# EAGLE schematic XmasRings (EAGLE 7.5.0)
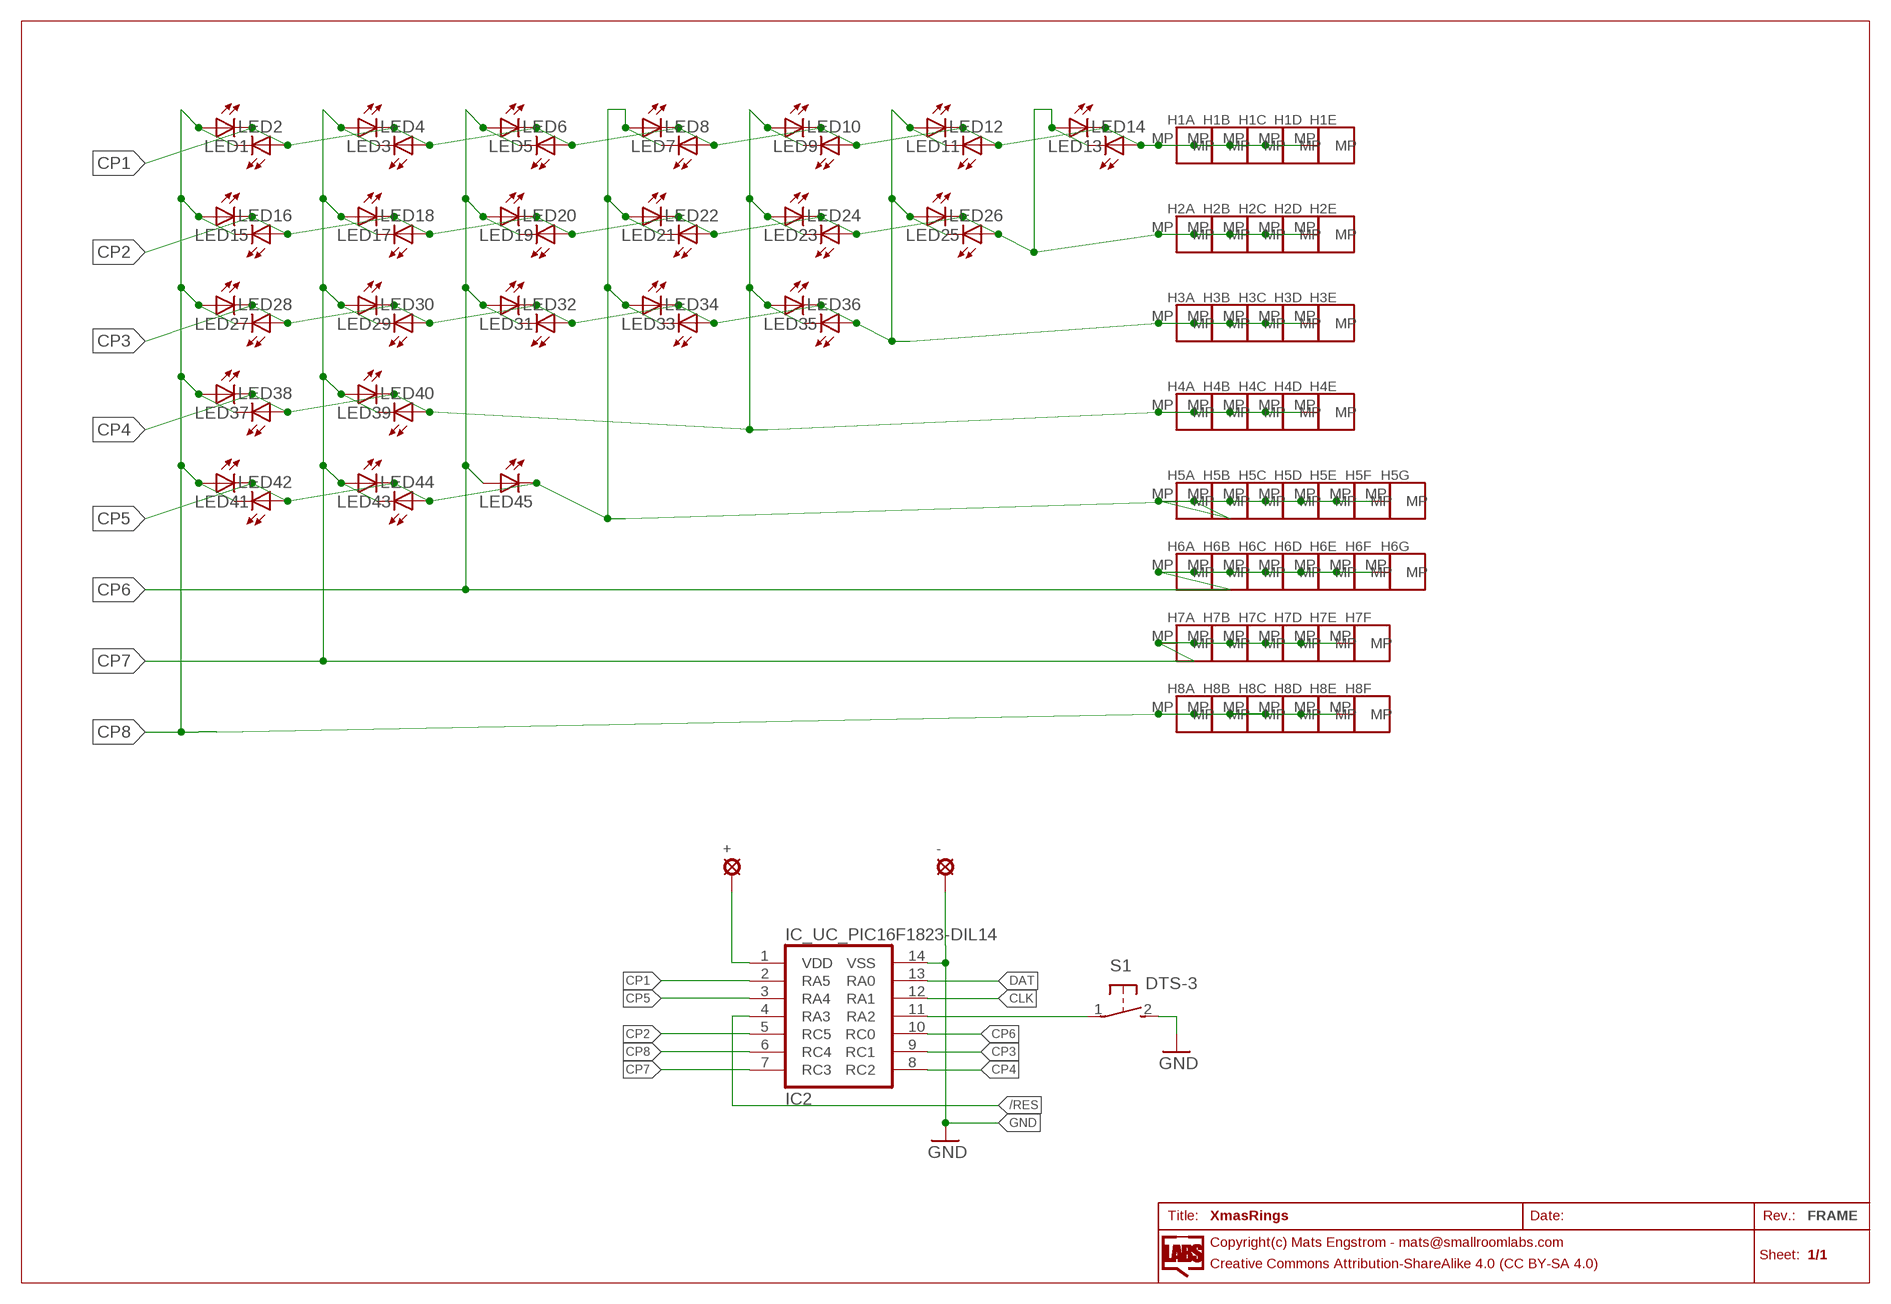
[diagram p0: schematic, sheet 1]

## Parts
+  LSP10  [LSP10]
-  LSP10  [LSP10]
H1A  PADH08SS  [PAD08SS]
H1B  PADH08SS  [PAD08SS]
H1C  PADH08SS  [PAD08SS]
H1D  PADH08SS  [PAD08SS]
H1E  PADH08SS  [PAD08SS]
H2A  PADH08SS  [PAD08SS]
H2B  PADH08SS  [PAD08SS]
H2C  PADH08SS  [PAD08SS]
H2D  PADH08SS  [PAD08SS]
H2E  PADH08SS  [PAD08SS]
H3A  PADH08SS  [PAD08SS]
H3B  PADH08SS  [PAD08SS]
H3C  PADH08SS  [PAD08SS]
H3D  PADH08SS  [PAD08SS]
H3E  PADH08SS  [PAD08SS]
H4A  PADH08SS  [PAD08SS]
H4B  PADH08SS  [PAD08SS]
H4C  PADH08SS  [PAD08SS]
H4D  PADH08SS  [PAD08SS]
H4E  PADH08SS  [PAD08SS]
H5A  PADH08SS  [PAD08SS]
H5B  PADH08SS  [PAD08SS]
H5C  PADH08SS  [PAD08SS]
H5D  PADH08SS  [PAD08SS]
H5E  PADH08SS  [PAD08SS]
H5F  PADH08SS  [PAD08SS]
H5G  PADH08SS  [PAD08SS]
H6A  PADH08SS  [PAD08SS]
H6B  PADH08SS  [PAD08SS]
H6C  PADH08SS  [PAD08SS]
H6D  PADH08SS  [PAD08SS]
H6E  PADH08SS  [PAD08SS]
H6F  PADH08SS  [PAD08SS]
H6G  PADH08SS  [PAD08SS]
H7A  PADH08SS  [PAD08SS]
H7B  PADH08SS  [PAD08SS]
H7C  PADH08SS  [PAD08SS]
H7D  PADH08SS  [PAD08SS]
H7E  PADH08SS  [PAD08SS]
H7F  PADH08SS  [PAD08SS]
H8A  PADH08SS  [PAD08SS]
H8B  PADH08SS  [PAD08SS]
H8C  PADH08SS  [PAD08SS]
H8D  PADH08SS  [PAD08SS]
H8E  PADH08SS  [PAD08SS]
H8F  PADH08SS  [PAD08SS]
IC2  IC_UC_PIC16F1823-DIL14  [DIP14]
LED1  LED5SQ  [5MM-SQ]
LED2  LED5SQ  [5MM-SQ]
LED3  LED5SQ  [5MM-SQ]
LED4  LED5SQ  [5MM-SQ]
LED5  LED5SQ  [5MM-SQ]
LED6  LED5SQ  [5MM-SQ]
LED7  LED5SQ  [5MM-SQ]
LED8  LED5SQ  [5MM-SQ]
LED9  LED5SQ  [5MM-SQ]
LED10  LED5SQ  [5MM-SQ]
LED11  LED5SQ  [5MM-SQ]
LED12  LED5SQ  [5MM-SQ]
LED13  LED5SQ  [5MM-SQ]
LED14  LED5SQ  [5MM-SQ]
LED15  LED5SQ  [5MM-SQ]
LED16  LED5SQ  [5MM-SQ]
LED17  LED5SQ  [5MM-SQ]
LED18  LED5SQ  [5MM-SQ]
LED19  LED5SQ  [5MM-SQ]
LED20  LED5SQ  [5MM-SQ]
LED21  LED5SQ  [5MM-SQ]
LED22  LED5SQ  [5MM-SQ]
LED23  LED5SQ  [5MM-SQ]
LED24  LED5SQ  [5MM-SQ]
LED25  LED5SQ  [5MM-SQ]
LED26  LED5SQ  [5MM-SQ]
LED27  LED5SQ  [5MM-SQ]
LED28  LED5SQ  [5MM-SQ]
LED29  LED5SQ  [5MM-SQ]
LED30  LED5SQ  [5MM-SQ]
LED31  LED5SQ  [5MM-SQ]
LED32  LED5SQ  [5MM-SQ]
LED33  LED5SQ  [5MM-SQ]
LED34  LED5SQ  [5MM-SQ]
LED35  LED5SQ  [5MM-SQ]
LED36  LED5SQ  [5MM-SQ]
LED37  LED5SQ  [5MM-SQ]
LED38  LED5SQ  [5MM-SQ]
LED39  LED5SQ  [5MM-SQ]
LED40  LED5SQ  [5MM-SQ]
LED41  LED5SQ  [5MM-SQ]
LED42  LED5SQ  [5MM-SQ]
LED43  LED5SQ  [5MM-SQ]
LED44  LED5SQ  [5MM-SQ]
LED45  LED5SQ  [5MM-SQ]
S1  DTS-3  [DTS-3]

## Nets
/RES: IC2.4(RA3)
CLK: IC2.12(RA1)
CP1: H1A.MP H1B.MP H1C.MP H1D.MP H1E.MP IC2.2(RA5) LED1.C LED2.A LED3.C LED4.A LED5.C LED6.A LED7.C LED8.A LED9.C LED10.A LED11.C LED12.A LED13.C LED14.A
CP2: H2A.MP H2B.MP H2C.MP H2D.MP H2E.MP IC2.5(RC5) LED13.A LED14.C LED15.C LED16.A LED17.C LED18.A LED19.C LED20.A LED21.C LED22.A LED23.C LED24.A LED25.C LED26.A
CP3: H3A.MP H3B.MP H3C.MP H3D.MP H3E.MP IC2.9(RC1) LED11.A LED12.C LED25.A LED26.C LED27.C LED28.A LED29.C LED30.A LED31.C LED32.A LED33.C LED34.A LED35.C LED36.A
CP4: H4A.MP H4B.MP H4C.MP H4D.MP H4E.MP IC2.8(RC2) LED9.A LED10.C LED23.A LED24.C LED35.A LED36.C LED37.C LED38.A LED39.C LED40.A
CP5: H5A.MP H5B.MP H5C.MP H5D.MP H5E.MP H5F.MP H5G.MP IC2.3(RA4) LED7.A LED8.C LED21.A LED22.C LED33.A LED34.C LED41.C LED42.A LED43.C LED44.A LED45.C
CP6: H6A.MP H6B.MP H6C.MP H6D.MP H6E.MP H6F.MP H6G.MP IC2.10(RC0) LED5.A LED6.C LED19.A LED20.C LED31.A LED32.C LED45.A
CP7: H7A.MP H7B.MP H7C.MP H7D.MP H7E.MP H7F.MP IC2.7(RC3) LED3.A LED4.C LED17.A LED18.C LED29.A LED30.C LED39.A LED40.C LED43.A LED44.C
CP8: H8A.MP H8B.MP H8C.MP H8D.MP H8E.MP H8F.MP IC2.6(RC4) LED1.A LED2.C LED15.A LED16.C LED27.A LED28.C LED37.A LED38.C LED41.A LED42.C
DAT: IC2.13(RA0)
GND: -.MP IC2.14(VSS) S1.2
N$1: IC2.11(RA2) S1.1
VCC: +.MP IC2.1(VDD)

## Library data of the parts
+ - = solpad:LSP10: SOLDER PAD drill 1.0 mm, distributor Buerklin, 12H555
H1A H1B H1C H1D H1E H2A H2B H2C H2D H2E H3A H3B H3C H3D H3E H4A H4B H4C H4D H4E H5A H5B H5C H5D H5E H5F H5G H6A H6B H6C H6D H6E H6F H6G H7A H7B H7C H7D H7E H7F H8A H8B H8C H8D H8E H8F = SmallRoomLabs_ConSwitch:PAD
IC2 = dp_devices:IC_UC_PIC16F1823
LED1-LED45 = SmallRoomLabs_Led:LED
S1 = tact:DTS-3

## Net classes
0 default: width 0.152 mm, drill 0.305 mm, clearance 0.152 mm